# EAGLE design Motherboard v1 (EAGLE 9.7.0)
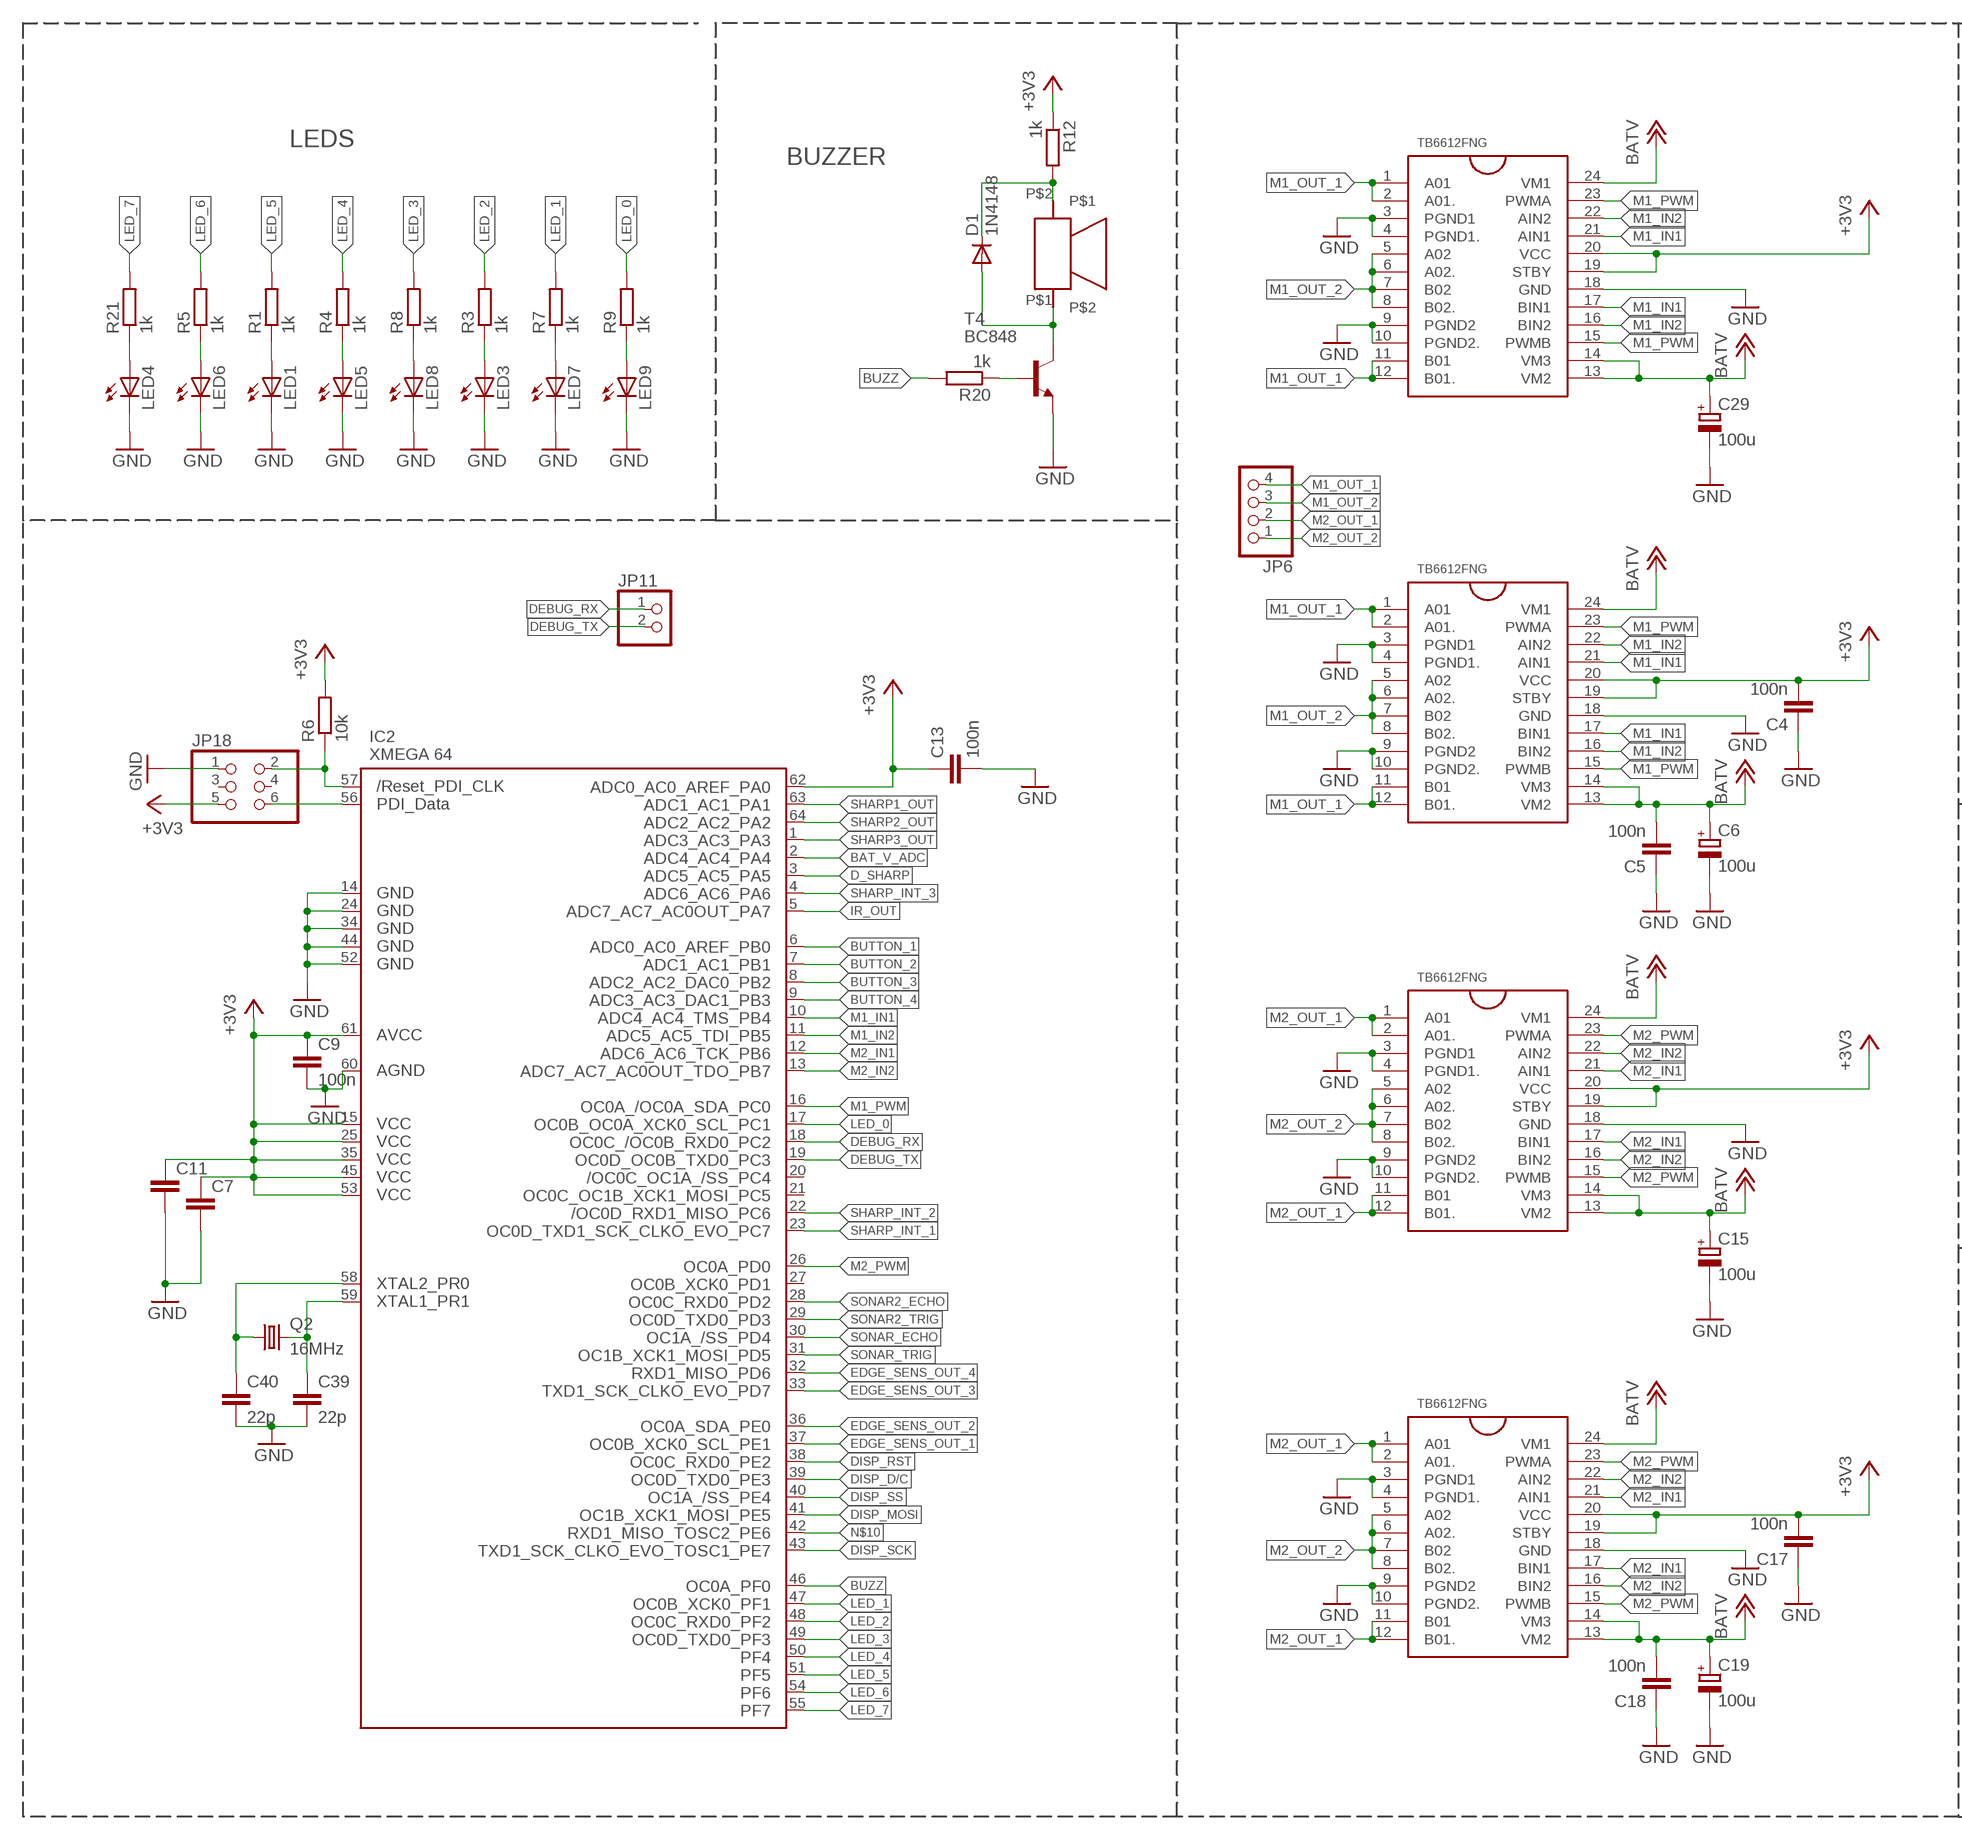
[diagram p0: schematic, sheet 1, part 1 of 2]
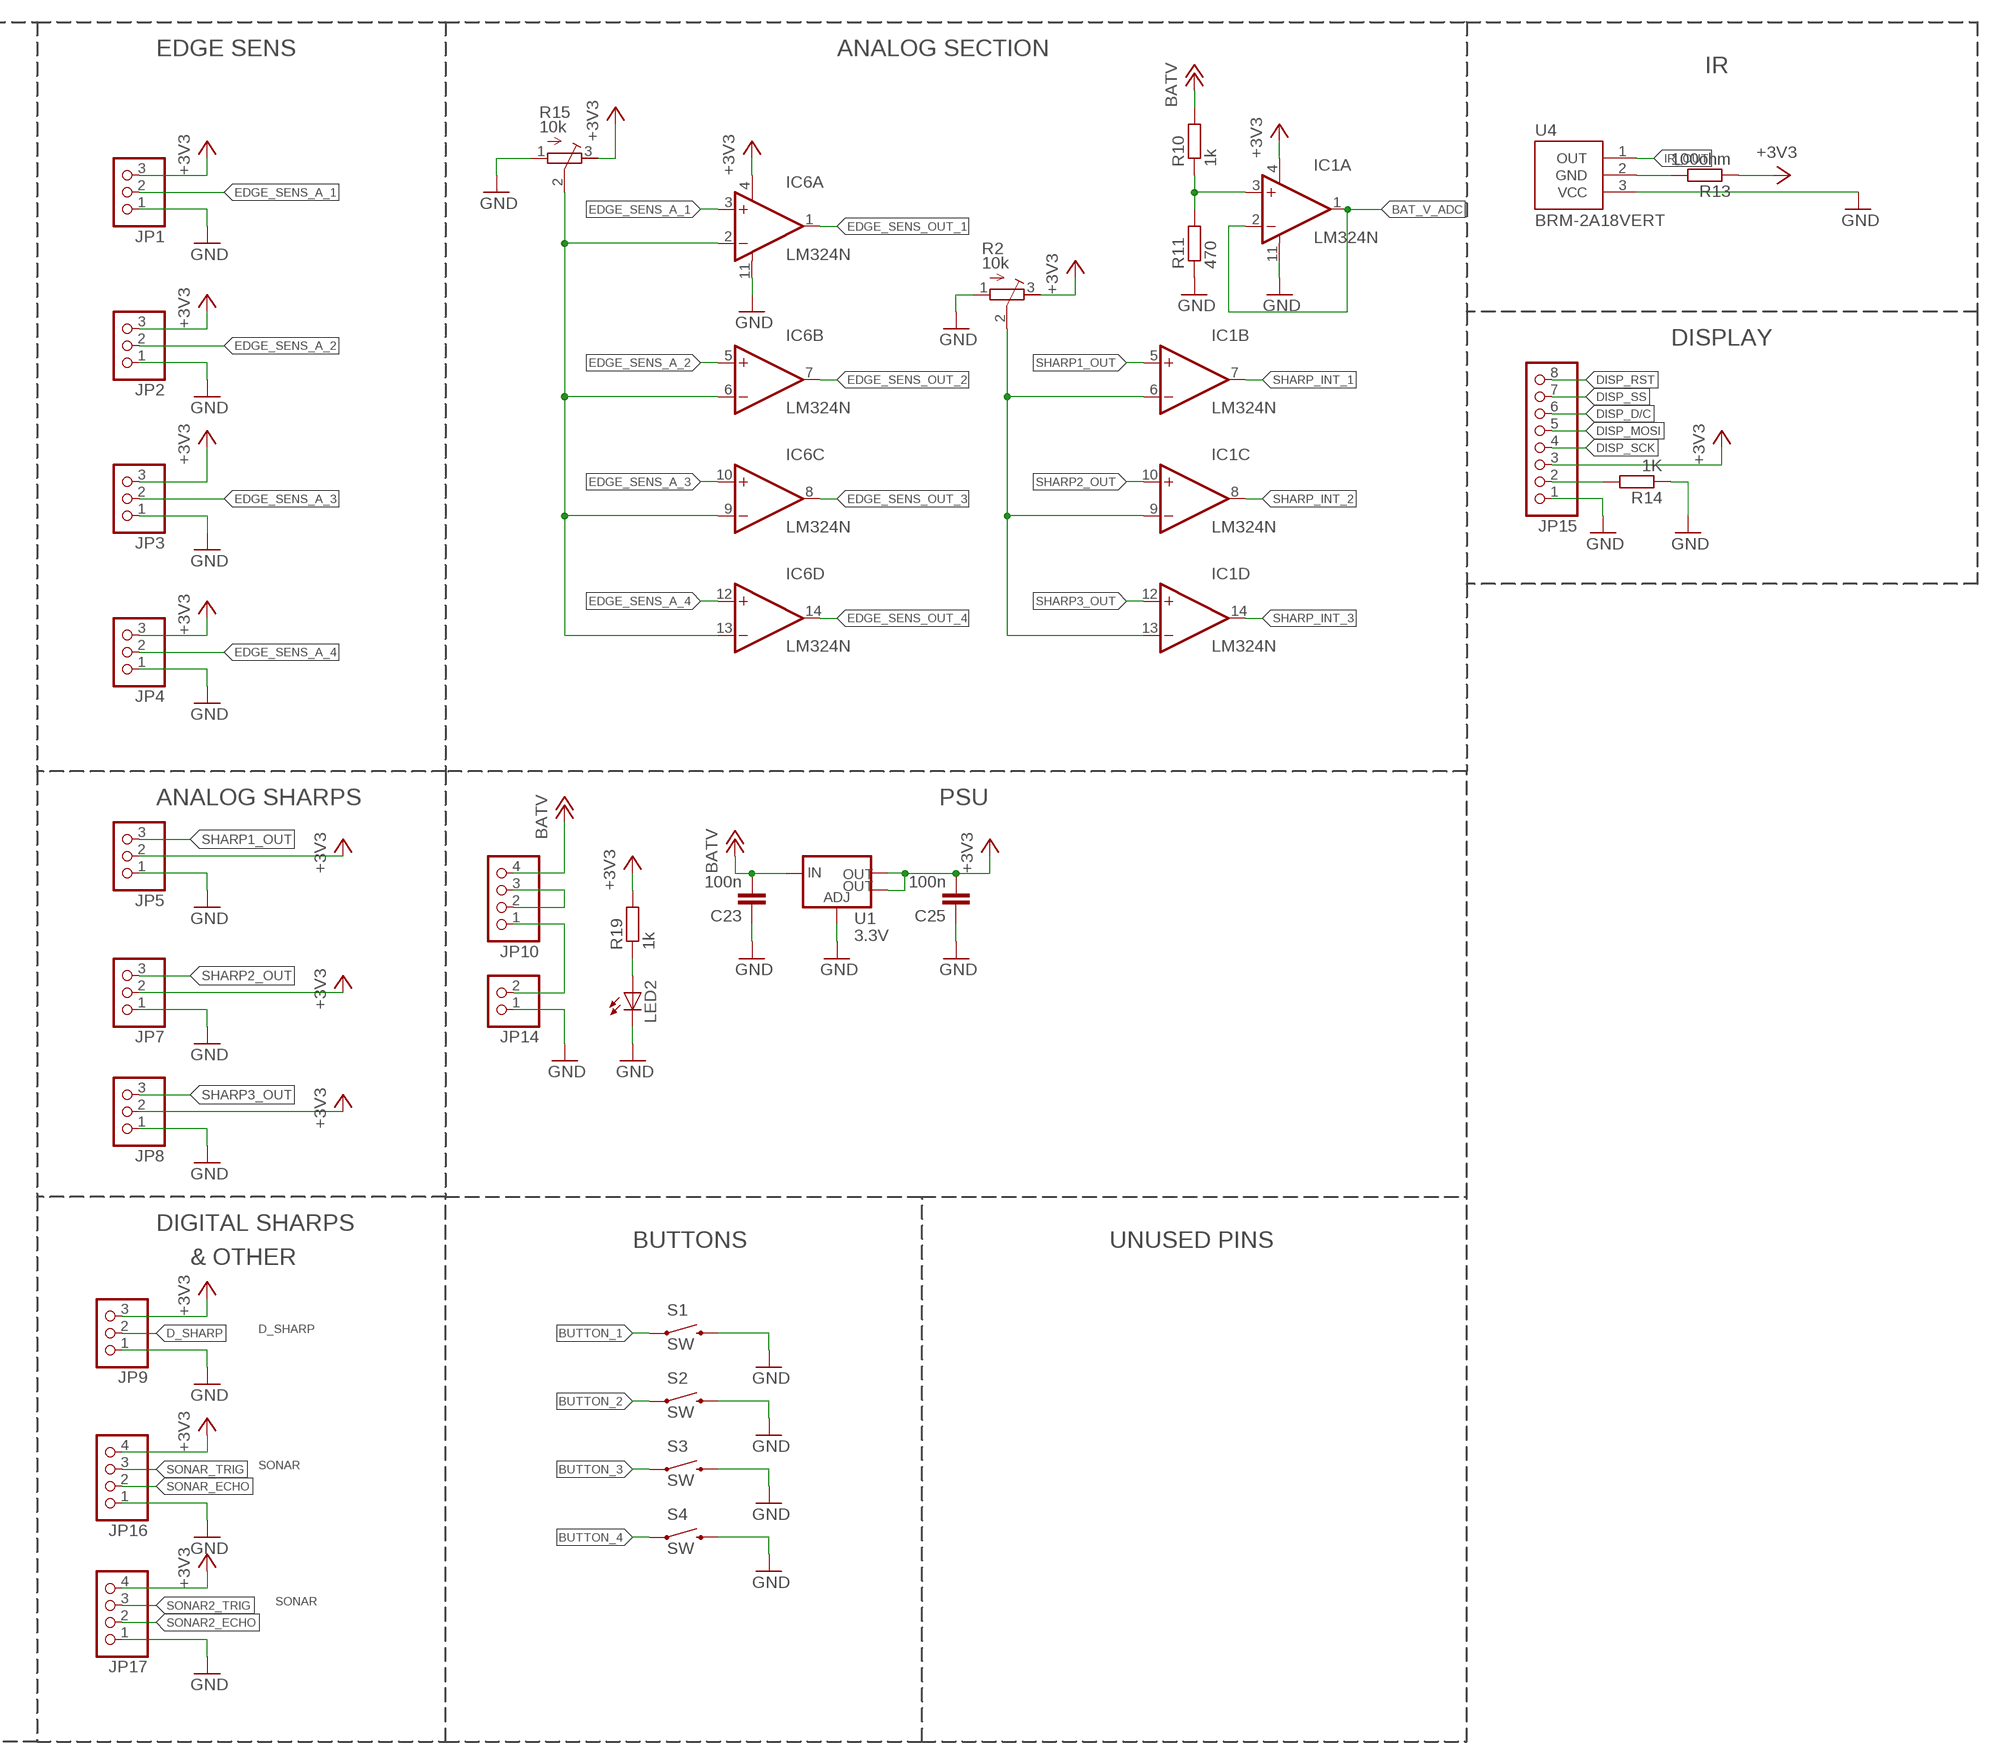
[diagram p1: schematic, sheet 1, part 2 of 2]

## Parts
C4  100n  C-EUC1206  [C1206]
C5  100n  C-EUC1206  [C1206]
C6  100u  CPOL-EU153CLV-0605  [153CLV-0605]
C7  C-EUC1206  [C1206]
C9  100n  C-EUC1206  [C1206]
C11  C-EUC1206  [C1206]
C13  100n  C-EUC1206  [C1206]
C15  100u  CPOL-EU153CLV-0605  [153CLV-0605]
C17  100n  C-EUC1206  [C1206]
C18  100n  C-EUC1206  [C1206]
C19  100u  CPOL-EU153CLV-0605  [153CLV-0605]
C23  100n  C-EUC1206  [C1206]
C25  100n  C-EUC1206  [C1206]
C29  100u  CPOL-EU153CLV-0605  [153CLV-0605]
C39  22p  C-EUC1206  [C1206]
C40  22p  C-EUC1206  [C1206]
D1  1N4148  ES2D  [SMB]
IC1  LM324N  OPA4130U  [SO14]
IC2  XMEGA 64  AVR_XMEGA_A3_  [TQFP64]
IC6  LM324N  OPA4130U  [SO14]
JP1  PINHD-1X3  [1X03]
JP2  PINHD-1X3  [1X03]
JP3  PINHD-1X3  [1X03]
JP4  PINHD-1X3  [1X03]
JP5  PINHD-1X3  [1X03]
JP6  PINHD-1X4/90  [1X04/90]
JP7  PINHD-1X3  [1X03]
JP8  PINHD-1X3  [1X03]
JP9  PINHD-1X3  [1X03]
JP10  PINHD-1X4/90  [1X04/90]
JP11  PINHD-1X2  [1X02]
JP14  PINHD-1X2  [1X02]
JP15  PINHD-1X8  [1X08]
JP16  PINHD-1X4  [1X04]
JP17  PINHD-1X4  [1X04]
JP18  PINHD-2X3  [2X03]
LED1  LEDCHIPLED_0805  [CHIPLED_0805]
LED2  LEDCHIPLED_0805  [CHIPLED_0805]
LED3  LEDCHIPLED_0805  [CHIPLED_0805]
LED4  LEDCHIPLED_0805  [CHIPLED_0805]
LED5  LEDCHIPLED_0805  [CHIPLED_0805]
LED6  LEDCHIP-LED0805  [CHIP-LED0805]
LED7  LEDCHIPLED_0805  [CHIPLED_0805]
LED8  LEDCHIP-LED0805  [CHIP-LED0805]
LED9  LEDCHIPLED_0805  [CHIPLED_0805]
Q2  16MHz  CSM-7X-DU  [CSM-7X-DU]
R1  1k  R-EU_R1206  [R1206]
R2  10k  R-TRIMMTSM53YL  [RTRIMTSM53YL]
R3  1k  R-EU_R1206  [R1206]
R4  1k  R-EU_R1206  [R1206]
R5  1k  R-EU_R1206  [R1206]
R6  10k  R-EU_R1206  [R1206]
R7  1k  R-EU_R1206  [R1206]
R8  1k  R-EU_R1206  [R1206]
R9  1k  R-EU_R1206  [R1206]
R10  1k  R-EU_R1206  [R1206]
R11  470  R-EU_R1206  [R1206]
R12  1k  R-EU_R1206  [R1206]
R13  100ohm  R-EU_R1206  [R1206]
R14  1K  R-EU_R1206  [R1206]
R15  10k  R-TRIMMTSM53YL  [RTRIMTSM53YL]
R19  1k  R-EU_R1206  [R1206]
R20  1k  R-EU_R1206  [R1206]
R21  1k  R-EU_R1206  [R1206]
S1  SW  SWITCH-MOMENTARY-2SMD-1101NE  [TACTILE-SWITCH-1101NE]
S2  SW  SWITCH-MOMENTARY-2SMD-1101NE  [TACTILE-SWITCH-1101NE]
S3  SW  SWITCH-MOMENTARY-2SMD-1101NE  [TACTILE-SWITCH-1101NE]
S4  SW  SWITCH-MOMENTARY-2SMD-1101NE  [TACTILE-SWITCH-1101NE]
T4  BC848  [SOT23]
U1  3.3V  V_REG_LM1117SOT223  [SOT223]
U4  BRM-2A18VERT  [BRM-2508_VERT]
U$1  TB6612FNG  [SSOP24]
U$2  TB6612FNG  [SSOP24]
U$3  TB6612FNG  [SSOP24]
U$4  TB6612FNG  [SSOP24]
U$13  BOT-03  [BOT-03D]

## Nets
+3V3: C4.2 C7.1 C9.1 C11.1 C13.1 C17.2 C25.2 IC1.4(A:V+) IC2.15(VCC1) IC2.25(VCC2) IC2.35(VCC3) IC2.45(VCC4) IC2.53(VCC5) IC2.61(AVCC) IC2.62(PA0) IC6.4(A:V+) JP1.3 JP2.3 JP3.3 JP4.3 JP5.2 JP7.2 JP8.2 JP9.3 JP15.3 JP16.4 JP17.4 JP18.5 R2.3(E) R6.2 R12.1 R13.1 R15.3(E) R19.2 U1.2(OUT) U1.4(OUT) U$1.19(STBY) U$1.20(VCC) U$2.19(STBY) U$2.20(VCC) U$3.19(STBY) U$3.20(VCC) U$4.19(STBY) U$4.20(VCC)
+12V: C5.2 C6.+ C15.+ C18.2 C19.+ C23.2 C29.+ JP10.4 R10.2 U1.3(IN) U$1.13(VM2) U$1.14(VM3) U$1.24(VM1) U$2.13(VM2) U$2.14(VM3) U$2.24(VM1) U$3.13(VM2) U$3.14(VM3) U$3.24(VM1) U$4.13(VM2) U$4.14(VM3) U$4.24(VM1) ; supply symbol labelled BATV
BAT_V_ADC: IC1.1(A:OUT) IC1.2(A:-IN) IC2.2(PA4)
BUTTON_1: IC2.6(PB0) S1.1
BUTTON_2: IC2.7(PB1) S2.1
BUTTON_3: IC2.8(PB2) S3.1
BUTTON_4: IC2.9(PB3) S4.1
BUZZ: IC2.46(PF0) R20.2
D_SHARP: IC2.3(PA5) JP9.2
DEBUG_RX: IC2.18(PC2) JP11.1
DEBUG_TX: IC2.19(PC3) JP11.2
DISP_D/C: IC2.39(PE3) JP15.6
DISP_MOSI: IC2.41(PE5) JP15.5
DISP_RST: IC2.38(PE2) JP15.8
DISP_SCK: IC2.43(PE7) JP15.4
DISP_SS: IC2.40(PE4) JP15.7
EDGE_SENS_A_1: IC6.3(A:+IN) JP1.2
EDGE_SENS_A_2: IC6.5(B:+IN) JP2.2
EDGE_SENS_A_3: IC6.10(C:+IN) JP3.2
EDGE_SENS_A_4: IC6.12(D:+IN) JP4.2
EDGE_SENS_OUT_1: IC2.37(PE1) IC6.1(A:OUT)
EDGE_SENS_OUT_2: IC2.36(PE0) IC6.7(B:OUT)
EDGE_SENS_OUT_3: IC2.33(PD7) IC6.8(C:OUT)
EDGE_SENS_OUT_4: IC2.32(PD6) IC6.14(D:OUT)
GND: C4.1 C5.1 C6.- C7.2 C9.2 C11.2 C13.2 C15.- C17.1 C18.1 C19.- C23.1 C25.1 C29.- C39.2 C40.2 IC1.11(A:V-) IC2.14(GND1) IC2.24(GND2) IC2.34(GND3) IC2.44(GND4) IC2.52(GND5) IC2.60(AGND) IC6.11(A:V-) JP1.1 JP2.1 JP3.1 JP4.1 JP5.1 JP7.1 JP8.1 JP9.1 JP14.1 JP15.1 JP16.1 JP17.1 JP18.1 LED1.C LED2.C LED3.C LED4.C LED5.C LED6.C LED7.C LED8.C LED9.C R2.1(A) R11.1 R14.1 R15.1(A) S1.2 S2.2 S3.2 S4.2 T4.2(E) U1.1(ADJ) U4.3(VCC) U$1.3(PGND1) U$1.4(PGND1.) U$1.9(PGND2) U$1.10(PGND2.) U$1.18(GND) U$2.3(PGND1) U$2.4(PGND1.) U$2.9(PGND2) U$2.10(PGND2.) U$2.18(GND) U$3.3(PGND1) U$3.4(PGND1.) U$3.9(PGND2) U$3.10(PGND2.) U$3.18(GND) U$4.3(PGND1) U$4.4(PGND1.) U$4.9(PGND2) U$4.10(PGND2.) U$4.18(GND)
IR_OUT: IC2.5(PA7) U4.1(OUT)
LED_0: IC2.17(PC1) R9.2
LED_1: IC2.47(PF1) R7.2
LED_2: IC2.48(PF2) R3.2
LED_3: IC2.49(PF3) R8.2
LED_4: IC2.50(PF4) R4.2
LED_5: IC2.51(PF5) R1.2
LED_6: IC2.54(PF6) R5.2
LED_7: IC2.55(PF7) R21.2
M1_IN1: IC2.10(PB4) U$1.17(BIN1) U$1.21(AIN1) U$2.17(BIN1) U$2.21(AIN1)
M1_IN2: IC2.11(PB5) U$1.16(BIN2) U$1.22(AIN2) U$2.16(BIN2) U$2.22(AIN2)
M1_OUT_1: JP6.4 U$1.1(A01) U$1.2(A01.) U$1.11(B01) U$1.12(B01.) U$2.1(A01) U$2.2(A01.) U$2.11(B01) U$2.12(B01.)
M1_OUT_2: JP6.3 U$1.5(A02) U$1.6(A02.) U$1.7(B02) U$1.8(B02.) U$2.5(A02) U$2.6(A02.) U$2.7(B02) U$2.8(B02.)
M1_PWM: IC2.16(PC0) U$1.15(PWMB) U$1.23(PWMA) U$2.15(PWMB) U$2.23(PWMA)
M2_IN1: IC2.12(PB6) U$3.17(BIN1) U$3.21(AIN1) U$4.17(BIN1) U$4.21(AIN1)
M2_IN2: IC2.13(PB7) U$3.16(BIN2) U$3.22(AIN2) U$4.16(BIN2) U$4.22(AIN2)
M2_OUT_1: JP6.2 U$3.1(A01) U$3.2(A01.) U$3.11(B01) U$3.12(B01.) U$4.1(A01) U$4.2(A01.) U$4.11(B01) U$4.12(B01.)
M2_OUT_2: JP6.1 U$3.5(A02) U$3.6(A02.) U$3.7(B02) U$3.8(B02.) U$4.5(A02) U$4.6(A02.) U$4.7(B02) U$4.8(B02.)
M2_PWM: IC2.26(PD0) U$3.15(PWMB) U$3.23(PWMA) U$4.15(PWMB) U$4.23(PWMA)
N$1: LED1.A R1.1
N$2: LED5.A R4.1
N$3: LED6.A R5.1
N$4: LED3.A R3.1
N$5: LED7.A R7.1
N$6: LED8.A R8.1
N$7: LED9.A R9.1
N$8: R13.2 U4.2(GND)
N$9: JP10.2 JP10.3
N$10: IC2.42(PE6)
N$11: D1.C R12.2 U$13.P$2
N$14: IC2.56(PDI_DATA) JP18.6
N$15: IC2.57(RESET) JP18.2 R6.1
N$16: JP10.1 JP14.2
N$17: IC1.6(B:-IN) IC1.9(C:-IN) IC1.13(D:-IN) R2.2(S)
N$18: D1.A T4.3(C) U$13.P$1
N$21: R20.1 T4.1(B)
N$22: IC6.2(A:-IN) IC6.6(B:-IN) IC6.9(C:-IN) IC6.13(D:-IN) R15.2(S)
N$24: JP15.2 R14.2
N$27: IC1.3(A:+IN) R10.1 R11.2
N$64: C40.1 IC2.58(PR0) Q2.1
N$65: C39.1 IC2.59(PR1) Q2.2
N$67: LED2.A R19.1
N$69: LED4.A R21.1
SHARP1_OUT: IC1.5(B:+IN) IC2.63(PA1) JP5.3
SHARP2_OUT: IC1.10(C:+IN) IC2.64(PA2) JP7.3
SHARP3_OUT: IC1.12(D:+IN) IC2.1(PA3) JP8.3
SHARP_INT_1: IC1.7(B:OUT) IC2.23(PC7)
SHARP_INT_2: IC1.8(C:OUT) IC2.22(PC6)
SHARP_INT_3: IC1.14(D:OUT) IC2.4(PA6)
SONAR2_ECHO: IC2.28(PD2) JP17.2
SONAR2_TRIG: IC2.29(PD3) JP17.3
SONAR_ECHO: IC2.30(PD4) JP16.2
SONAR_TRIG: IC2.31(PD5) JP16.3
Unconnected: IC2.20(PC4) IC2.21(PC5) IC2.27(PD1) JP18.3 JP18.4

## Notes on the sheet
- EDGE SENS | ANALOG SECTION
- IR
- LEDS
- BUZZER
- DISPLAY
- ANALOG SHARPS | PSU
- DIGITAL SHARPS
- BUTTONS | UNUSED PINS
- & OTHER
- D_SHARP
- SONAR
- SONAR

## Library data of the parts
C4 C5 C7 C9 C11 C13 C17 C18 C23 C25 C39 C40 = rcl:C-EU: CAPACITOR, European symbol
C6 C15 C19 C29 = resistor:CPOL-EU: POLARIZED CAPACITOR, European symbol
D1 = diode:ES2D: DIODE super fast rectifier, 2 A
IC1 IC6 = burr-brown:OPA4130: Low Power, Precision FET-Input Operational Amplifiers; MF: TEXAS INSTRUMENTS; MPN: OPA4130UA; OC_FARNELL: 1648707; OC_NEWARK: 80K8080
IC2 = xmega:AVR_XMEGA_A3_: Device for Atmel AVR XMEGA A3 Series
JP1-JP5 JP7-JP9 = pinhead:PINHD-1X3: PIN HEADER
JP6 JP10 JP16 JP17 = pinhead:PINHD-1X4: PIN HEADER
JP11 JP14 = pinhead:PINHD-1X2: PIN HEADER
JP15 = pinhead:PINHD-1X8: PIN HEADER
JP18 = pinhead:PINHD-2X3: PIN HEADER
LED1-LED9 = led:LED: LED OSRAM: - CHIPLED LG R971, LG N971, LY N971, LG Q971, LY Q971, LO R971, LY R971 LH N974, LH R974 LS Q976, LO Q976, LY Q976 LO Q996 - Hyper CHIPLED LW Q18S LB Q993, LB Q99A, LB R99A - SideLED LS A670, LO A670, LY A670, LG A670, LP A670 LB A673, LV A673, LT A673, LW A673 LH A674 LY A675 LS A676, LA A676, LO A676, LY A676, LW A676 LS A679, LY A679, LG A679 - Hyper Micro SIDELED® LS Y876, LA Y876, LO Y876, LY Y876 LT Y87S - SmartLED LW L88C, LW L88S LB L89C, LB L89S, LG L890 LS L89K, LO L89K, LY L89K LS L896, LA L896, LO L896, LY L896 - TOPLED LS T670, LO T670, LY T670, LG T670, LP T670 LSG T670, LSP T670, LSY T670, LOP T670, LYG T670 LG T671, LOG T671, LSG T671 LB T673, LV T673, LT T673, LW T673 LH T674 LS T676, LA T676, LO T676, LY T676, LB T676, LH T676, LSB T676, LW T676 LB T67C, LV T67C, LT T67C, LS T67K, LO T67K, LY T67K, LW E67C LS E67B, LA E67B, LO E67B, LY E67B, LB E67C, LV E67C, LT E67C LW T67C LS T679, LY T679, LG T679 LS T770, LO T770, LY T770, LG T770, LP T770 LB T773, LV T773, LT T773, LW T773 LH T774 LS E675, LA E675, LY E675, LS T675 LS T776, LA T776, LO T776, LY T776, LB T776 LHGB T686 LT T68C, LB T68C - Hyper Mini TOPLED® LB M676 - Mini TOPLED Santana® LG M470 LS M47K, LO M47K, LY M47K Source: http://www.osram.convergy.de LUXEON: - LUMILED® LXK2-PW12-R00, LXK2-PW12-S00, LXK2-PW14-U00, LXK2-PW14-V00 LXK2-PM12-R00, LXK2-PM12-S00, LXK2-PM14-U00 LXK2-PE12-Q00, LXK2-PE12-R00, LXK2-PE12-S00, LXK2-PE14-T00, LXK2-PE14-U00 LXK2-PB12-K00, LXK2-PB12-L00, LXK2-PB12-M00, LXK2-PB14-N00, LXK2-PB14-P00, LXK2-PB14-Q00 LXK2-PR12-L00, LXK2-PR12-M00, LXK2-PR14-Q00, LXK2-PR14-R00 LXK2-PD12-Q00, LXK2-PD12-R00, LXK2-PD12-S00 LXK2-PH12-R00, LXK2-PH12-S00 LXK2-PL12-P00, LXK2-PL12-Q00, LXK2-PL12-R00 Source: www.luxeon.com KINGBRIGHT: KA-3528ASYC Source: www.kingbright.com
Q2 = crystal:CSM-7X-DU: SMD CRYSTAL Source: www.ecsxtal.com .. Crystal 3.6864MHz CSM_7X_DU.PDF; OC_FARNELL: unknown; OC_NEWARK: unknown
R1 R3-R14 R19-R21 = rcl:R-EU_: RESISTOR, European symbol
R2 R15 = rcl:R-TRIMM: Trimm resistor
S1-S4 = SparkFun-Electromechanical:SWITCH-MOMENTARY-2: Various NO switches- pushbuttons, reed, etc; PROD_ID: SWCH-00815
T4 = transistor:BC848: NPN TRANSISTOR
U1 = SparkFun-PowerIC:V_REG_LM1117: Voltage Regulator LM1117 Standard adjustable voltage regulator but in SMD form. Spark Fun Electronics SKU : COM-00595; PROD_ID: VREG-08170
U4 = SparkFun-Sensors:BRM-2A18: BRM-2A18 IR receiver.; PROD_ID: COMP-12505
U$1-U$4 = TB6612FNG:TB6612FNG
U$13 = bot3:BOT-03

## Board
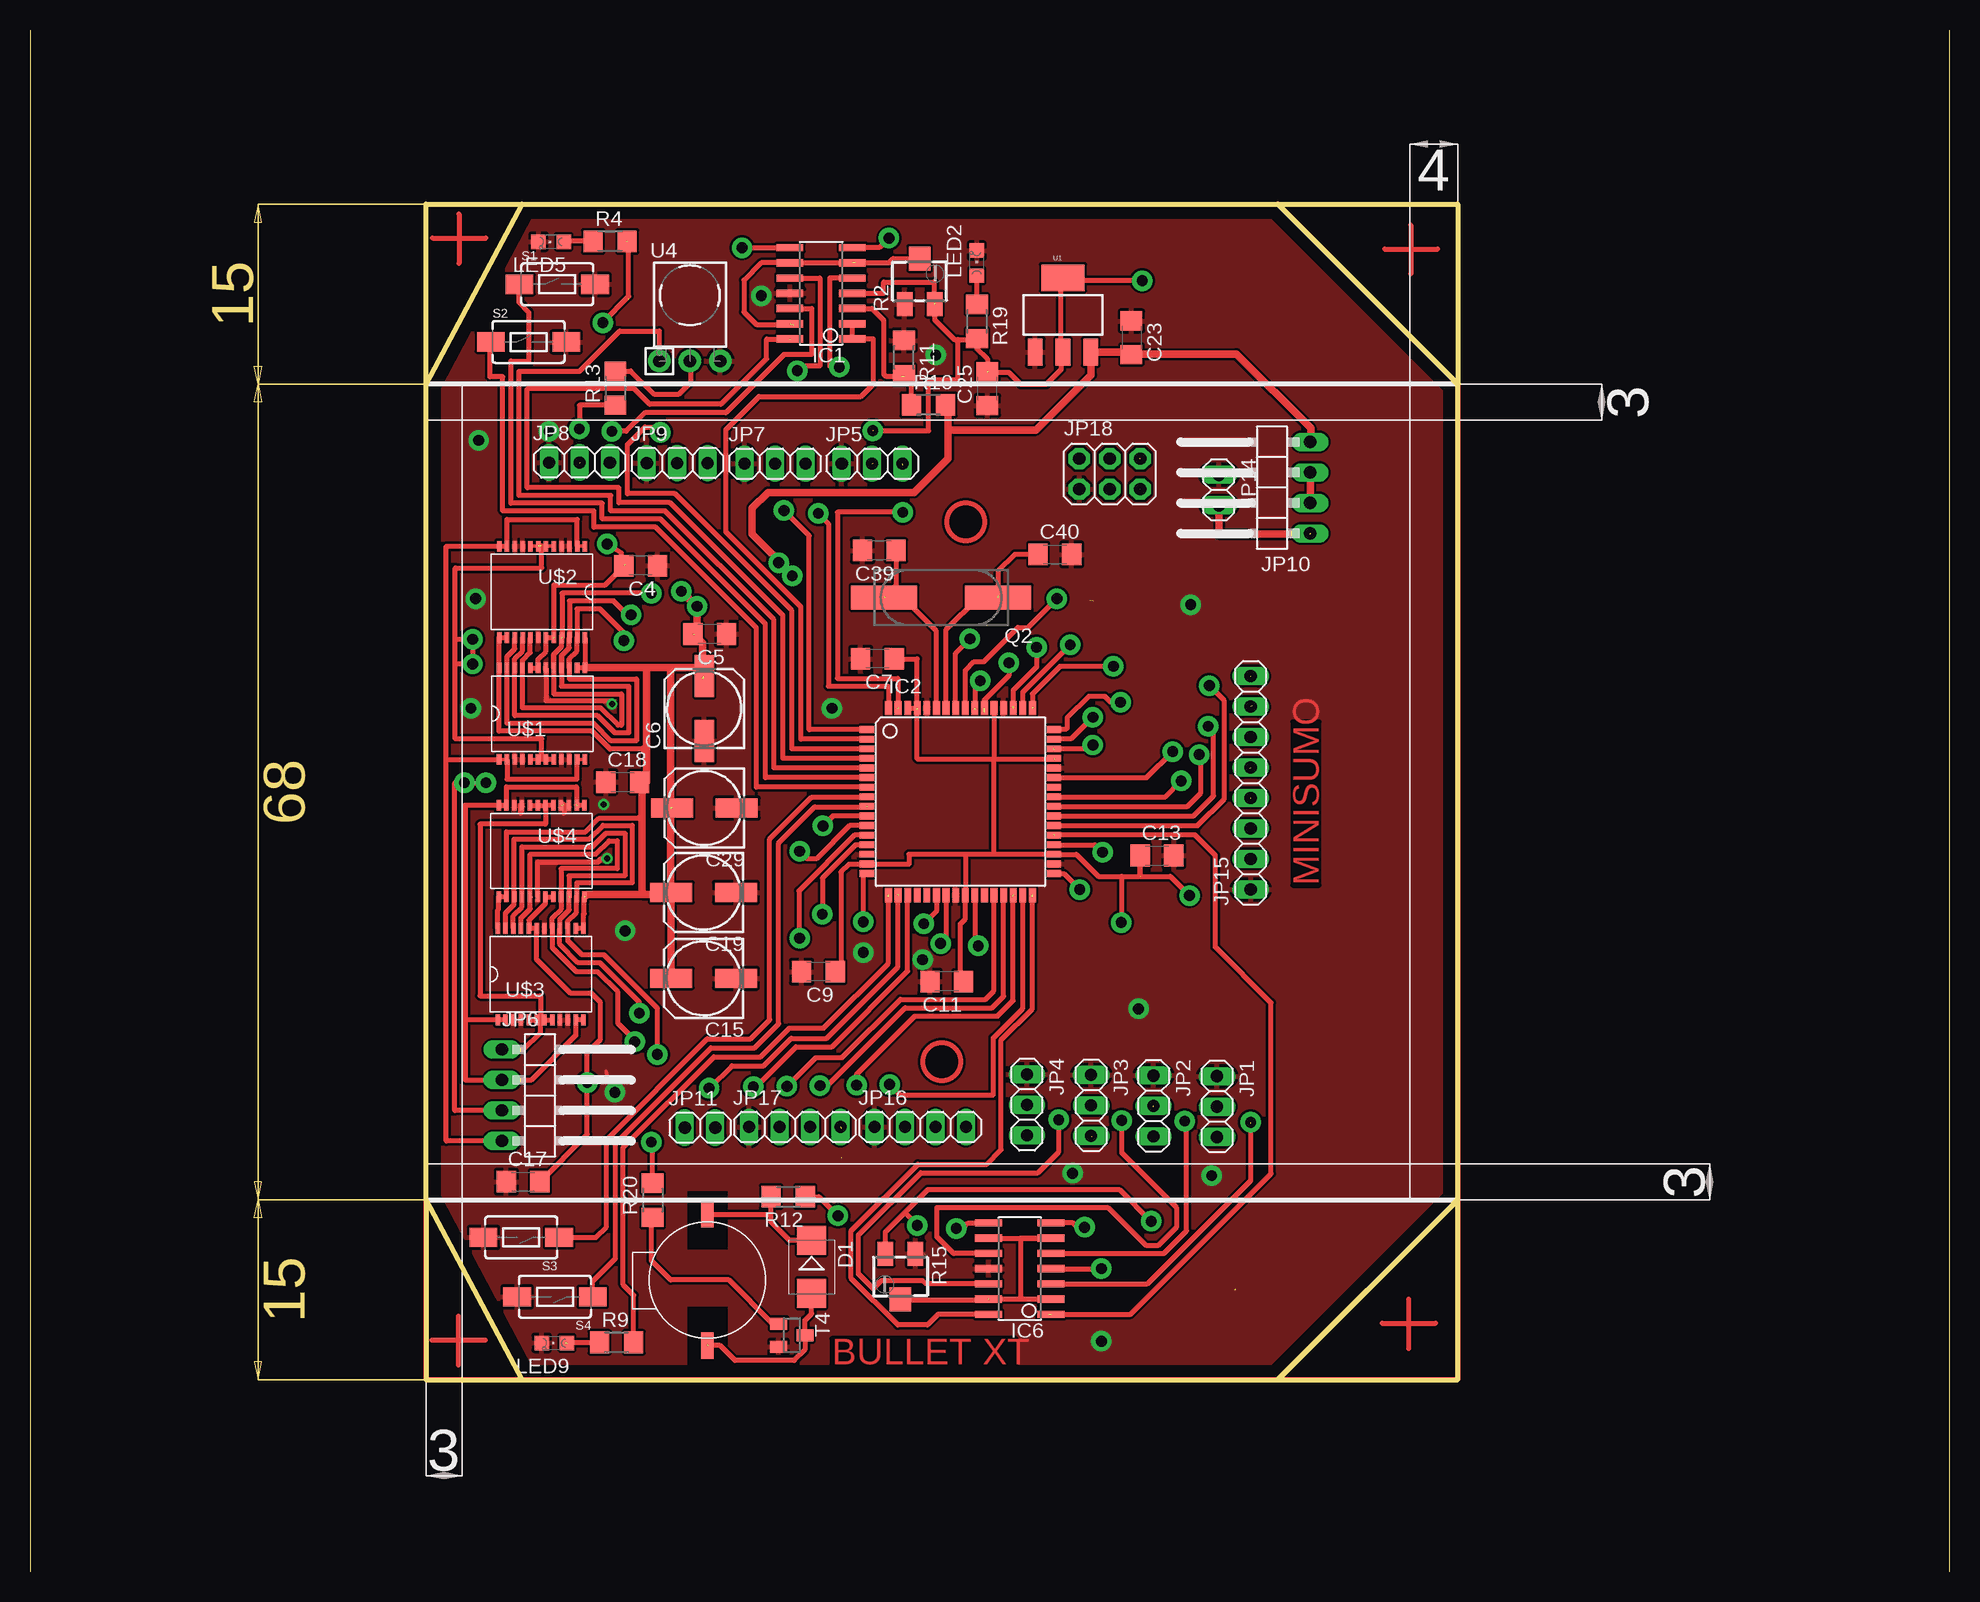
[diagram p2: board, top side]
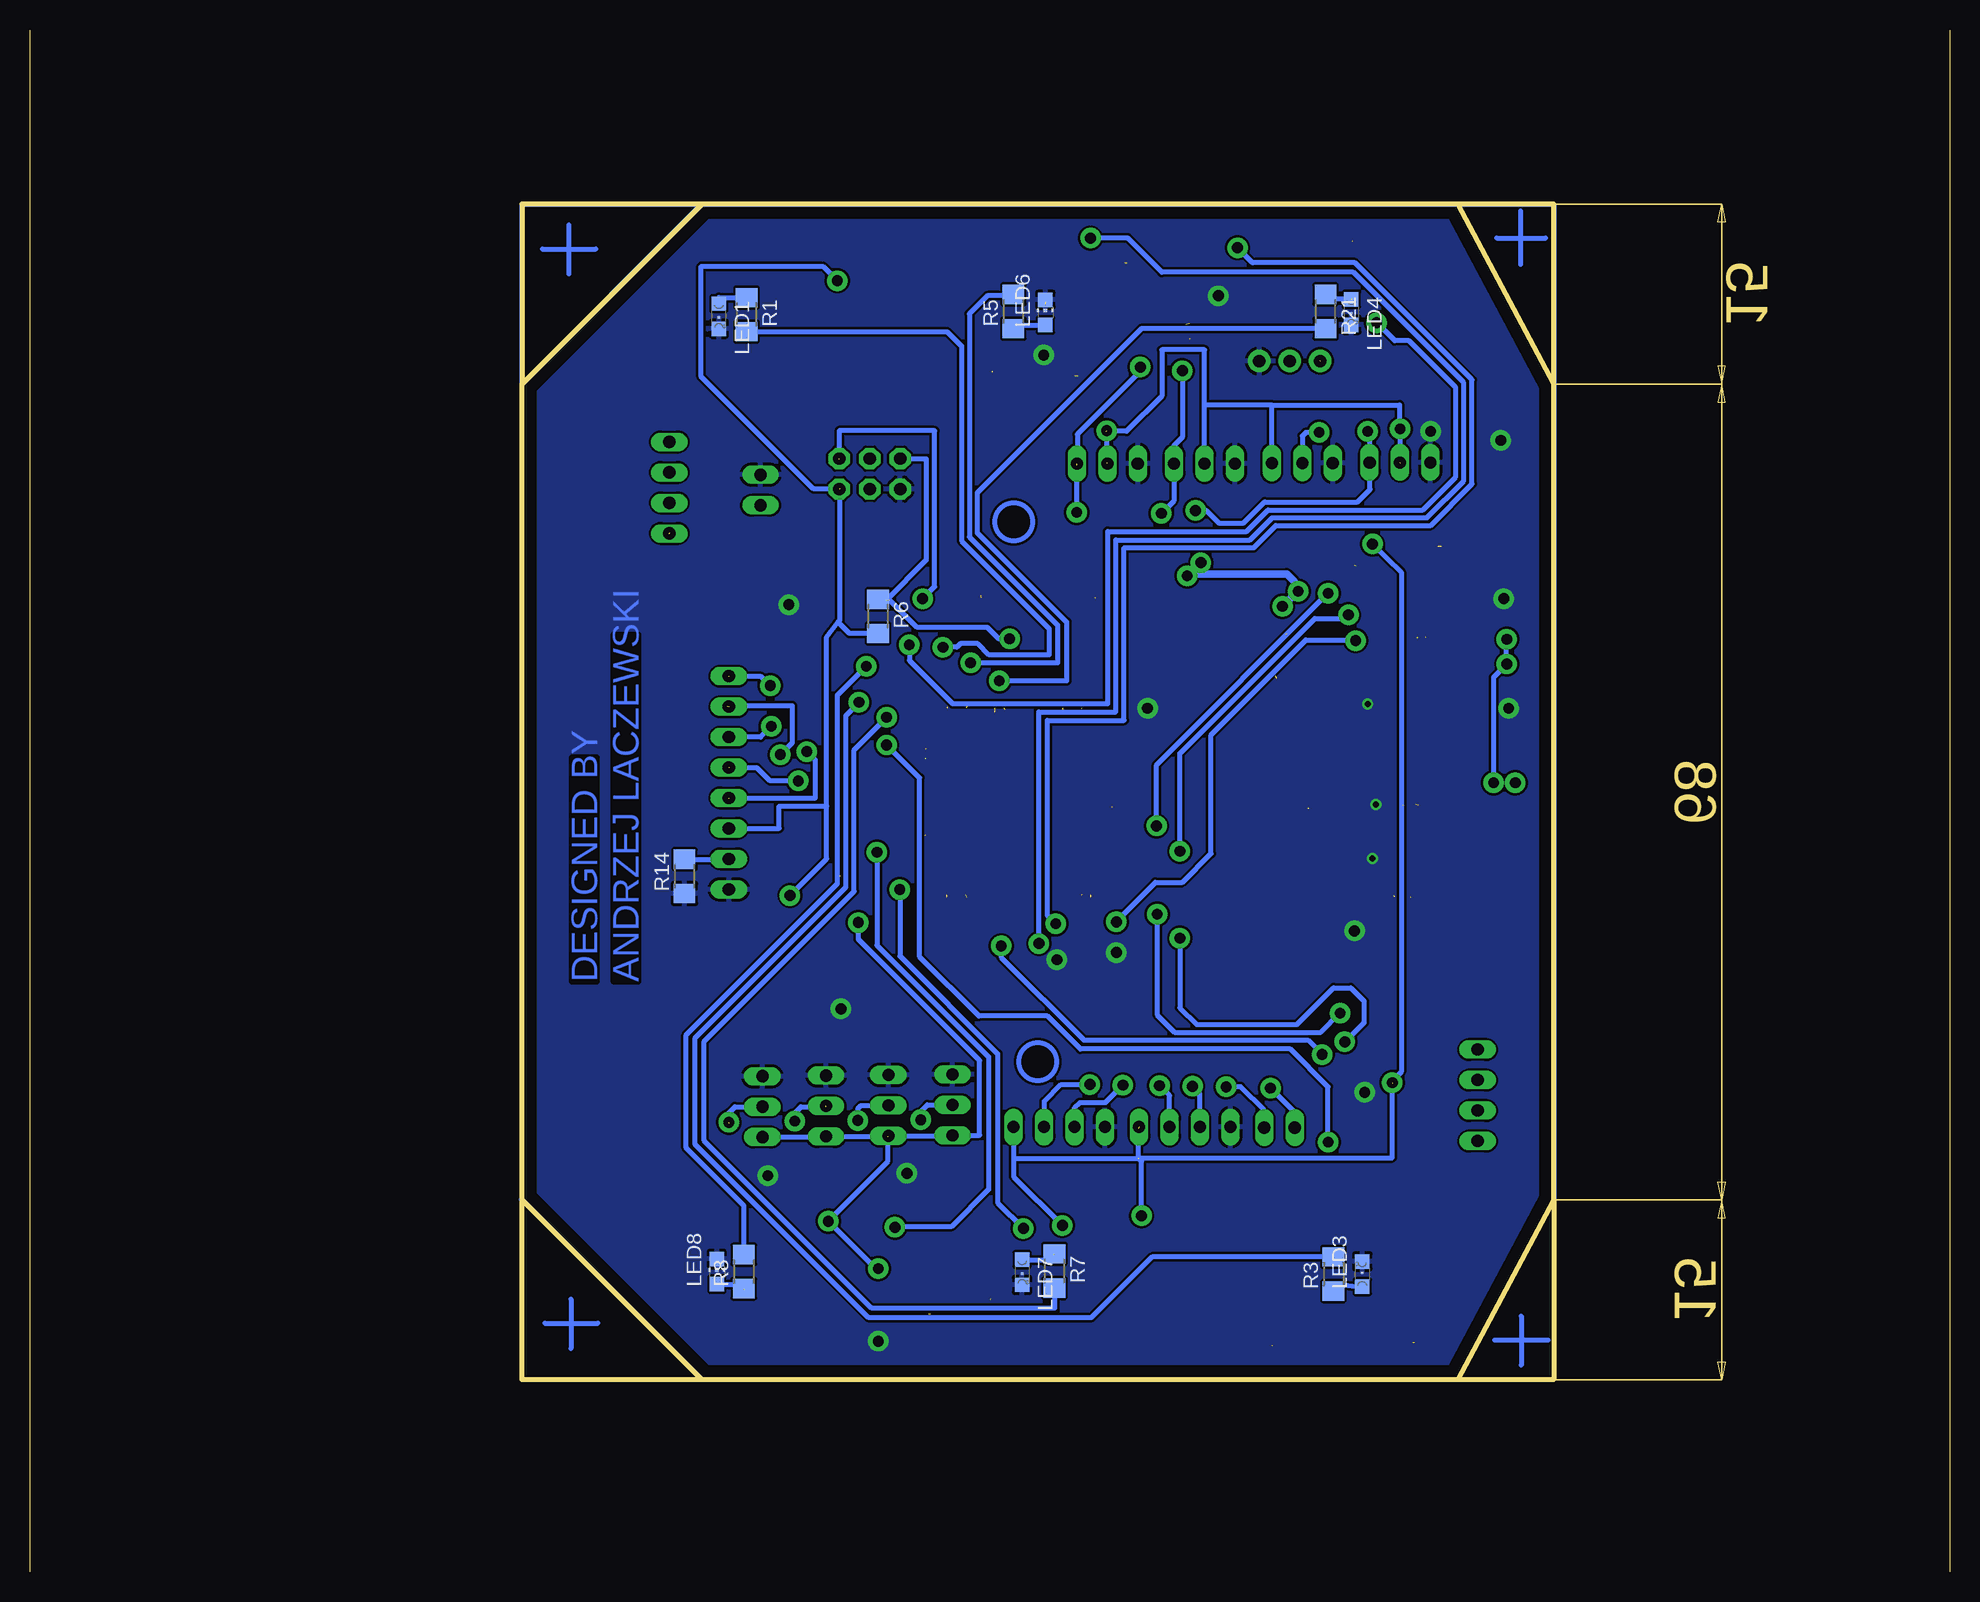
[diagram p3: board, bottom side, seen from below]

Size 160 x 128.5 mm. Coordinates in mm from the lower left corner, seen from the top.
Outline: 160,0 160,128.5
Outline: 0,128.5 0,0
Outline: 33,31 33,99
Outline: 119,31 119,99
Outline: 33,99 33,114 41,114
Outline: 41,114 104,114
Outline: 104,114 119,114 119,99
Outline: 33,31 33,16 41,16
Outline: 41,16 104,16
Outline: 104,16 119,16 119,31
Outline: 33,99 41,114
Outline: 33,31 41,16
Outline: 119,99 104,114
Outline: 119,31 104,16
Copper layers (1*16): Top 0.035mm / dielectric 1.5mm / Bottom 0.035mm
Design rules "Fusion Electronics Design Rules": minimum track width 10mil, minimum drill 24mil, track to track 8mil, track to pad 8mil, pad to pad 8mil, via to via 8mil, smd to smd 8mil, copper to edge 40mil, drill to drill 8mil, minimum pad ring 10mil, minimum via ring 8mil, stop-mask expansion 4mil, vias tented up to drill 0mil, thermal gap 10mil
tRestrict: area 54.8,17.2 to 58.1,22.1; area 54.8,26.8 to 58.1,31.7

### Footprints (pad centres in the part's own frame; a part is rotated, then mirrored left to right if it is on the bottom)
C1206 = smd 1.6 x 1.8: 1 -1.4,0; 2 1.4,0
153CLV-0605 = smd 3.5 x 1.6: + 2.7,0; - -2.7,0
SMB = smd 2.4 x 2.4: A 2.2,0; C -2.2,0
SO14 = smd 0.61 x 2.21: 1 -3.81,-2.603; 2 -2.54,-2.603; 3 -1.27,-2.603; 4 0,-2.603; 5 1.27,-2.603; 6 2.54,-2.603; 7 3.81,-2.603; 8 3.81,2.603; 9 2.54,2.603; 10 1.27,2.603; 11 0,2.603; 12 -1.27,2.603; 13 -2.54,2.603; 14 -3.81,2.603
TQFP64 = smd 1.194 x 0.559: 1 -7.8,6; 2 -7.8,5.2; 3 -7.8,4.4; 4 -7.8,3.6; 5 -7.8,2.8; 6 -7.8,2; 7 -7.8,1.2; 8 -7.8,0.4; 9 -7.8,-0.4; 10 -7.8,-1.2; 11 -7.8,-2; 12 -7.8,-2.8; 13 -7.8,-3.6; 14 -7.8,-4.4; 15 -7.8,-5.2; 16 -7.8,-6; 33 7.8,-6; 34 7.8,-5.2; 35 7.8,-4.4; 36 7.8,-3.6; 37 7.8,-2.8; 38 7.8,-2; 39 7.8,-1.2; 40 7.8,-0.4; 41 7.8,0.4; 42 7.8,1.2; 43 7.8,2; 44 7.8,2.8; 45 7.8,3.6; 46 7.8,4.4; 47 7.8,5.2; 48 7.8,6 | smd 0.559 x 1.194: 17 -6,-7.8; 18 -5.2,-7.8; 19 -4.4,-7.8; 20 -3.6,-7.8; 21 -2.8,-7.8; 22 -2,-7.8; 23 -1.2,-7.8; 24 -0.4,-7.8; 25 0.4,-7.8; 26 1.2,-7.8; 27 2,-7.8; 28 2.8,-7.8; 29 3.6,-7.8; 30 4.4,-7.8; 31 5.2,-7.8; 32 6,-7.8; 49 6,7.8; 50 5.2,7.8; 51 4.4,7.8; 52 3.6,7.8; 53 2.8,7.8; 54 2,7.8; 55 1.2,7.8; 56 0.4,7.8; 57 -0.4,7.8; 58 -1.2,7.8; 59 -2,7.8; 60 -2.8,7.8; 61 -3.6,7.8; 62 -4.4,7.8; 63 -5.2,7.8; 64 -6,7.8
1X03 = drill 1.016 long: 1 -2.54,0; 2 0,0; 3 2.54,0
1X04/90 = drill 1.016 long: 1 -3.81,-3.81; 2 -1.27,-3.81; 3 1.27,-3.81; 4 3.81,-3.81
1X02 = drill 1.016 long: 1 -1.27,0; 2 1.27,0
1X08 = drill 1.016 long: 1 -8.89,0; 2 -6.35,0; 3 -3.81,0; 4 -1.27,0; 5 1.27,0; 6 3.81,0; 7 6.35,0; 8 8.89,0
1X04 = drill 1.016 long: 1 -3.81,0; 2 -1.27,0; 3 1.27,0; 4 3.81,0
2X03 = drill 1.016 pad 1.778 octagon: 1 -2.54,-1.27; 2 -2.54,1.27; 3 0,-1.27; 4 0,1.27; 5 2.54,-1.27; 6 2.54,1.27
CHIPLED_0805 = smd 1.2 x 1.2: A 0,-1.05; C 0,1.05
CHIP-LED0805 = smd 1.2 x 1.2: A 0,-1.05; C 0,1.05
CSM-7X-DU = smd 5.5 x 2: 1 -4.75,0; 2 4.75,0
R1206 = smd 1.6 x 1.803: 1 -1.422,0; 2 1.422,0
RTRIMTSM53YL = smd 1.3 x 2: 1 -1.25,-1.9; 3 1.25,-1.9 | smd 1.8 x 2: 2 0,1.9
TACTILE-SWITCH-1101NE = smd 2.3 x 1.6: 1 -3.15,0; 2 3.15,0
SOT23 = smd 1 x 1.4: 1 -0.95,-1.1; 2 0.95,-1.1; 3 0,1.1
SOT223 = smd 1.219 x 2.235: 1 -2.311,-3.099; 2 0,-3.099; 3 2.311,-3.099 | smd 3.6 x 2.2: 4 0,3.099
BRM-2508_VERT = drill 1.016 pad 1.88: 1 -2.54,0; 2 0,0; 3 2.54,0
SSOP24 = smd 0.381 x 0.889: 1 -3.567,-3.72; 2 -2.917,-3.72; 3 -2.268,-3.72; 4 -1.617,-3.72; 5 -0.968,-3.72; 6 -0.318,-3.72; 7 0.333,-3.72; 8 0.983,-3.72; 9 1.633,-3.72; 10 2.283,-3.72; 11 2.933,-3.72; 12 3.583,-3.72; 13 3.583,3.9; 14 2.933,3.9; 15 2.283,3.9; 16 1.633,3.9; 17 0.983,3.9; 18 0.333,3.9; 19 -0.318,3.9; 20 -0.968,3.9; 21 -1.617,3.9; 22 -2.268,3.9; 23 -2.917,3.9; 24 -3.567,3.9
BOT-03D = smd 2.184 x 1.067: P$1 -5.461,-0.254; P$2 5.461,-0.254

### Placement (x,y rotation side)
C4  50.9,83.85 180 top
C5  56.65,78.15 180 top
C6  56.2,71.95 90 top
C7  70.64,76.08 180 top
C9  65.72,50 180 top
C11  76.42,49.18 180 top
C13  93.94,59.69 0 top
C15  56.15,49.45 180 top
C17  41.1,32.5 0 top
C18  49.4,65.8 0 top
C19  56.15,56.6 180 top
C23  91.8,102.85 270 top
C25  79.8,98.6 90 top
C29  56.2,63.65 180 top
C39  70.79,85.11 180 top
C40  85.43,84.79 0 top
D1  65.15,25.4 270 top
IC1  65.95,106.55 90 top
IC2  77.56,64.18 0 top
IC6  82.5,25.25 90 top
JP1  98.95,38.75 270 top
JP2  93.65,38.8 270 top
JP3  88.45,38.85 270 top
JP4  83.1,38.9 270 top
JP5  70.2,92.35 0 top
JP6  43.15,39.7 270 top
JP7  62.1,92.35 0 top
JP8  45.8,92.45 0 top
JP9  53.95,92.4 0 top
JP10  102.9,90.35 90 top
JP11  55.85,37 0 top
JP14  99.1,90.15 270 top
JP15  101.75,65.75 90 top
JP16  74.2,37.05 0 top
JP17  63.75,37.05 0 top
JP18  90,91.5 0 top
LED1  102.58,104.64 180 bottom
LED2  78.92,109.07 0 top
LED3  48.95,24.8 0 bottom
LED4  49.86,104.98 180 bottom
LED5  43.44,110.85 90 top
LED6  75.37,104.96 0 bottom
LED7  77.3,24.95 180 bottom
LED8  102.75,25 0 bottom
LED9  43.7,19.05 90 top
Q2  75.95,81.2 180 top
R1  100.27,104.77 270 bottom
R2  74.15,107.55 0 top
R3  51.35,24.8 90 bottom
R4  48.36,110.88 0 top
R5  78.03,105.03 90 bottom
R6  89.31,79.62 270 bottom
R7  74.6,25.05 270 bottom
R8  100.5,25 90 bottom
R9  48.9,19.1 0 top
R10  74.9,97.25 0 top
R11  72.85,101.2 270 top
R12  63.2,31.25 180 top
R13  48.8,98.65 90 top
R14  105.45,57.95 90 bottom
R15  72.55,24.6 180 top
R19  78.94,104.2 270 top
R20  51.9,30.95 90 top
R21  52.01,105.03 270 bottom
S1  43.95,107.3 0 top
S2  41.55,102.5 0 top
S3  40.95,27.85 180 top
S4  43.75,22.9 180 top
T4  63.5,19.7 270 top
U1  86.1,104.75 0 top
U4  55,100.9 0 top
U$1  42.67,71.42 0 top
U$2  42.7,81.75 180 top
U$3  42.55,49.7 0 top
U$4  42.65,60.15 180 top
U$13  56.2,24.3 90 top

### Tracks (layer width: path | path; a pad name or v marks a point on that pad's centre or on a via)
+3V3  (via drill 0.9 pad 1.7)  (15 unrouted)
  Top 0.305: C4.2 49.3,84.05
  Top 0.406: IC2.62 IC2.61 73.95,76.08 C7.1 | U1.2 86.1,101.35 86.3,101.15 86.3,101.6 85.95,101.95 | U$4.20 U$4.19 42.95,56.23 42.95,55.65 41.6,54.3 41.6,53.62 U$3.20 42.2,53.6 | U$3.19 42.2,53.6 | 91,57.95 89.05,57.95 87.22,59.78 IC2.35 80.36,59.78 | 91,57.95 92.45,57.95 92.5,58 92.5,59.55 92.45,59.6 | C13.1 92.54,57.95 95.05,57.95 v96.65,56.35 | v90.95,54.1 91,54.15 91,57.95 | R15.3 71.3,28.3 72.92,29.93 | 72.92,29.93 74.85,31.85 90.8,31.85 v93.45,29.2 | v73.95,28.85 73.95,28.9 72.92,29.93 | R12.1 65.75,31.25 v67.35,29.65 | IC1.4 71.15,106.55 71.15,107.5 75.35,107.5 75.35,105.8 | R2.3 75.4,104.35 77.05,102.7 77.35,102.7 | 77.35,102.7 78.86,102.7 | 78.86,102.7 R19.2 | v70.25,95.1 74.9,95.1 74.9,99.35 77.35,99.35 77.35,102.7 | 45.8,95.58 v45.8,95.25 45.8,97.23 R13.1 | 78.86,102.7 78.86,102.04 79.8,101.1 79.8,100.05 79.85,100 | 85.95,101.95 85.95,100.2 84.7,98.95 82.6,98.95 81.6,99.95 79.85,99.95 C25.2 | 85.95,101.95 85.95,107.7 U1.4 86.35,107.6 v92.7,107.6 | 80.36,67.75 73.95,67.75 73.95,71.85 | 80.36,67.75 85.4,67.75 | IC2.53 80.36,67.75 | 80.36,59.78 80.36,67.75 | 80.36,59.78 77.96,59.78 | 77.96,59.78 IC2.25 77.96,54.41 77.55,54 77.55,49.45 C11.1 | 77.96,59.78 73.25,59.78 73.25,58.95 69.76,58.95 | 69.76,58.95 IC2.15 | IC6.4 v89.3,25.25 | U$1.20 U$1.19 42.35,76.05 43,76.7 43,77.83 U$2.19 43.65,77.85 | 69.76,58.95 68.25,58.95 67.6,58.3 67.6,50.48 C9.1 | 49.3,84.05 49.3,84.9 v48.1,85.65 | 42.2,53.6 42.15,53.65 | C17.2 46.45,36.45 v46.45,40.75 46.45,43.25 47.5,44.3 47.5,47.5 46.75,48.25 45,48.25 42.2,51.05 42.2,53.6 | U$2.20 43.67,82.25 47.95,82.25 49.6,83.9
  Bottom 0.406: JP15.3 97.55,61.94 97.55,63.8 93.6,63.8 | 93.6,63.8 93.6,77.9 92.63,79.14 | 92.63,79.14 92.5,79.3 92.5,90.25 | JP1.3 93.7,36.21 JP2.3 88.5,36.26 JP3.3 83.15,36.31 JP4.3 80.85,36.36 80.85,42.6 90.95,52.7 v90.95,54.1 | v96.65,56.35 93.6,59.4 93.6,63.8 | 88.35,36.3 88.4,36.35 88.5,36.25 88.5,34.2 93.45,29.25 v93.45,29.2 89.5,25.25 v89.3,25.25 | 67.6,36.95 67.6,34.45 78.01,34.45 JP16.4 78.01,32.91 v73.95,28.85 | v67.35,29.65 67.35,34.2 67.65,34.5 46.45,34.5 46.45,40.7 | 70.25,92.4 v70.25,95.1 | 45.8,92.4 v45.8,95.25 45.85,95.25 45.85,97.25 56.49,97.25 | JP9.3 56.49,97.25 | 56.49,97.25 62.1,97.25 | JP7.2 62.1,97.25 | 62.1,97.25 62.1,101.85 65.65,101.85 65.65,98 68.6,95.05 70.3,95.05 70.35,95.1 | JP18.5 94.68,90.23 104.05,99.6 104.05,108.8 93.9,108.8 v92.7,107.6 | R6.2 91.69,78.2 92.63,79.14 | v48.1,85.65 45.7,83.3 45.7,41.65 46.45,40.9 v46.45,40.75
+12V  (via drill 0.9 pad 1.7)  (4 unrouted)
  Top 0.406: 91.6,101.65 C23.2 91.85,101.5 | 88.55,101.51 U1.3 | U$3.14 U$3.13 46.13,54.78 46.2,54.85 46.2,56.23 U$4.24 | 50.85,62.8 47.45,62.8 46.3,61.65 39.72,61.65 U$4.14 U$4.13 39.05,56.23 39.05,55.2 38.98,55.13 U$3.24 | U$2.14 U$2.13 39.1,77.84 U$1.24 39.1,70.05 46.85,70.05 48.35,68.55 51.15,68.55 | U$2.24 46.27,75.34 U$1.13 U$1.14
  Top 0.61: 76.52,95.15 76.52,92.77 73.7,89.95 61.5,89.95 60.2,88.65 60.2,86.5 63.55,83.15 v63.55,83 | v55.6,80.45 55.6,78.35 55.35,78.1 56.05,77.4 56.05,75.35 | 56.05,75.35 56.05,74.45 | 53.9,75.35 53.4,75.35 53.4,63.65 | 53.9,75.35 56.05,75.35 | C29.+ 53.3,63.85 | C15.+ C19.+ 53.4,56.65 53.4,63.65 | 53.4,63.65 53.25,63.65 | 76.52,95.15 83.85,95.15 88.45,99.75 88.45,101.61 U1.3 91.6,101.65 | 76.52,95.15 76.52,97.05 R10.2 | 91.85,101.5 100.55,101.5 106.75,95.3 106.75,94.2 JP10.4 | 51,56.45 51,62.8 | 51,62.8 51,65.8 C18.2 51.4,65.8 51.4,68.55 | 50.85,62.8 51,62.8 | 46.27,75.34 51.4,75.34 | 51.4,75.34 51.4,68.55 | 51.4,75.34 53.9,75.34 53.9,75.35 | 51.15,68.55 51.4,68.55 | 51,56.45 52.55,56.45 | 51,56.45 46.45,56.45 46.3,56.3
  Bottom 0.61: v55.6,80.45 54.1,81.95 54.05,81.95 55.25,83.15 63.4,83.15 63.5,83.05 | v63.55,83 63.5,83.05 | 63.5,83.05 63.45,83.05 62.35,84.15
BAT_V_ADC
  Top 0.406: IC2.2 64.25,69.38 64.25,80.4 58,86.65 58,95.2 60.75,97.95 69.25,97.95 70.3,99 70.3,102.75 70.29,102.74 IC1.1 IC1.2
BUTTON_1
  Top 0.406: IC2.6 61.3,66.18 61.3,79 52.55,87.75 47.7,87.75 47.7,89.05 40.1,89.05 40.1,100.9 41.6,100.9 41.6,104.95 40.75,105.8 40.75,107.25 S1.1
BUTTON_2
  Top 0.406: IC2.7 60.55,65.38 60.55,78.65 52.15,87.05 47,87.05 47,88.4 39.4,88.4 39.4,99.6 38.35,99.6 38.35,102.5 S2.1
BUTTON_3
  Top 0.406: S3.1 47.15,27.85 48.05,28.75 48.05,36 56.45,44.4 60.05,44.4 61.65,46 61.65,61.05 65.15,64.55 69.73,64.55 IC2.8
BUTTON_4  (1 unrouted)
  Top 0.406: S4.1 46.9,24.2 48.8,26.1 48.8,35.7 56.75,43.65 60.4,43.65 62.4,45.65 62.4,60.75 65.4,63.75 69.8,63.75 69.9,63.85
BUZZ  (via drill 0.9 pad 1.7)  (1 unrouted)
  Top 0.406: R20.2 51.9,35.7 v51.8,35.8 | v88.6,68.9 88.25,68.55 85.3,68.55
  Bottom 0.406: v51.8,35.8 51.8,40.4 54.95,43.55 72.45,43.55 75.2,46.3 80.9,46.3 85.85,51.25 85.85,66.15 v88.6,68.9
D_SHARP  (via drill 0.9 pad 1.7)
  Top 0.406: IC2.3 63.5,68.58 63.5,80.1 53.75,89.85 49.8,89.85 49.8,93.95 51.25,95.4 52.1,95.4 v52.55,94.95
  Bottom 0.406: v52.55,94.95 53.65,94.95 53.95,94.65 JP9.2
DEBUG_RX  (via drill 0.9 pad 1.7)  (1 unrouted)
  Top 0.406: v56.6,40.3 56.65,40.3 58.5,42.15 61.15,42.15 63.45,44.45 66.4,44.45 72.35,50.4 72.35,56.45 72.4,56.5
  Bottom 0.406: JP11.1 54.58,38.28 v56.6,40.3
DEBUG_TX  (via drill 0.9 pad 1.7)
  Top 0.406: v60.3,40.4 60.5,40.4 63.85,43.75 66.85,43.75 73.15,50.05 IC2.19
  Bottom 0.406: JP11.2 57.12,38.42 59.1,40.4 v60.3,40.4
DISP_D/C  (via drill 0.9 pad 1.7)
  Top 0.406: IC2.39 96.98,62.98 98.65,64.65 98.65,70 v98.2,70.45
  Bottom 0.406: v98.2,70.45 99.09,69.56 JP15.6
DISP_MOSI  (via drill 0.9 pad 1.7)  (1 unrouted)
  Top 0.406: IC2.41 94.63,64.58 v95.95,65.9
  Bottom 0.406: v95.95,65.9 98.3,65.9 99.4,67 101.7,67 101.75,66.95
DISP_RST  (via drill 0.9 pad 1.7)  (1 unrouted)
  Top 0.406: IC2.38 97.33,62.18 99.55,64.4 99.55,72.6 v98.3,73.85
  Bottom 0.406: v98.3,73.85 99.05,74.6 101.75,74.6
DISP_SCK  (via drill 0.9 pad 1.7)  (1 unrouted)
  Top 0.406: IC2.43 93.08,66.18 v95.25,68.35
  Bottom 0.406: v95.25,68.35 94.55,67.65 94.55,64.5 94.6,64.45 101.75,64.45
DISP_SS  (via drill 0.9 pad 1.7)  (1 unrouted)
  Top 0.406: IC2.40 96.48,63.78 97.6,64.9 97.6,67.95 v97.45,68.1
  Bottom 0.406: v97.45,68.1 96.45,69.1 96.45,72.15 101.9,72.15
EDGE_SENS_A_1  (via drill 0.9 pad 1.7)  (1 unrouted)
  Top 0.406: IC6.3 93.13,23.98 101.75,32.6 101.75,37.35
  Bottom 0.406: v101.75,37.45 101.75,38.25 101.25,38.75 JP1.2
EDGE_SENS_A_2  (via drill 0.9 pad 1.7)  (1 unrouted)
  Top 0.406: IC6.5 94.52,26.52 96.4,28.4 96.4,37.4 v96.25,37.55
  Bottom 0.406: v96.25,37.55 96.25,38.25 95.75,38.75 93.65,38.75
EDGE_SENS_A_3  (via drill 0.9 pad 1.7)
  Top 0.406: IC6.10 76.98,26.52 75.6,27.9 75.6,30.35 89.85,30.35 93,27.2 94.05,27.2 95.6,28.75 95.6,30.3 91,34.9 v91,37.6
  Bottom 0.406: v91,37.6 91,38.6 90.75,38.85 JP3.2
EDGE_SENS_A_4  (via drill 0.9 pad 1.7)
  Top 0.406: v85.75,37.65 85.75,35 84,33.25 74.25,33.25 69.05,28.05 69.05,24.8 70.25,23.6 70.3,23.6 70.95,24.25 74.4,24.25 74.67,23.98 IC6.12
  Bottom 0.406: v85.75,37.65 85.75,38.35 85.2,38.9 JP4.2
EDGE_SENS_OUT_1  (2 unrouted)
  Top 0.406: 84.95,21.45 84.9,21.5 | IC6.1 91.74,21.44 103.45,33.15 103.45,47.4 98.8,52.05 98.8,59.7 97.1,61.4 85.4,61.4
EDGE_SENS_OUT_2  (via drill 0.9 pad 1.7)
  Top 0.406: IC2.36 88.77,60.58 v89.4,59.95 | v87.9,28.7 87.3,28.7 86.95,29.05 85.11,29.05 IC6.7
  Bottom 0.406: v89.4,59.95 89.4,52.2 80.1,42.9 80.1,31.85 83.2,28.75 87.85,28.75 v87.9,28.7
EDGE_SENS_OUT_3  (via drill 0.9 pad 1.7)
  Top 0.406: IC2.33 86.17,58.18 v87.5,56.85 | v77.2,28.6 77.75,28.6 78.2,29.05 79.89,29.05 IC6.8
  Bottom 0.406: v87.5,56.85 87.5,51.3 79.35,43.15 79.35,30.75 v77.2,28.6
EDGE_SENS_OUT_4  (1 unrouted)
  Top 0.406: IC6.14 75.69,21.44 74.8,20.55 72.35,20.55 68.45,24.45 68.45,28.4 74,33.95 79.75,33.95 80.95,35.15 80.95,44.3 83.55,46.9 83.55,56.25
GND  (via drill 0.5 pad 0.61, 0.9 pad 1.7)  (1 unrouted)
  Top 0.305: 48,41.7 48.15,41.15
  Top 0.406: U$4.9 40.9,63.22 40.9,63.95 | 44.5,63.95 44.5,63.2 | U$4.18 42.32,59.15 47.4,59.15 arc-90 47.65,59.4 v48.1,59.45 | U$1.18 43,72.6 48.45,72.6 48.45,72.3
  other vias: 48.5,72.3 47.8,63.95 98.5,33 86.9,33.2 69.45,51.6 74.4,51 66.85,71.95 75.5,101.4 60.95,106.35 43.25,95.05 36.75,71.95 37.15,81.1 37.4,94.3 92.4,46.9 89.3,19.2 49.6,53.4 48.75,39.95 96.75,80.6
  pour Top: 41,16 104,16 119,31 119,99 104,114 41,114 33,99 33,31
  pour Bottom: 41,16 104,16 119,31 119,99 104,114 41,114 33,99 33,31
IR_OUT  (1 unrouted)
  Top 0.406: IC2.5 62,66.98 62,79.35 52.95,88.4 48.4,88.4 48.4,89.7 40.75,89.7 40.75,100.05 45.8,100.05 49.15,103.4 52.45,103.4 U4.1
LED_0  (1 unrouted)
  Top 0.406: R9.2 50.32,23.03 49.45,23.9 49.45,35.35 57,42.9 60.9,42.9 63.3,45.3 66.15,45.3 71.55,50.7 71.55,56.25
LED_1  (via drill 0.9 pad 1.7)
  Top 0.406: v88.6,71.2 88.55,71.2 86.75,69.4 85.38,69.4 IC2.47
  Bottom 0.406: R7.2 74.6,21.95 89.85,21.95 103.8,35.9 103.8,44.2 91.3,56.7 91.3,68.5 v88.6,71.2
LED_2  (via drill 0.9 pad 1.7)
  Top 0.406: v90.9,72.45 90.1,72.45 89.6,72.95 88.25,72.95 86.45,71.15 86.45,70.3 86.35,70.2 85.38,70.2 IC2.48
  Bottom 0.406: R3.2 66.48,26.22 71.55,21.15 90.1,21.15 104.55,35.6 104.55,44.5 92,57.05 92,71.35 v90.9,72.45
LED_3  (via drill 0.9 pad 1.7)  (1 unrouted)
  Top 0.406: v90.3,75.45 85.85,75.45 83.55,73.15 83.55,72.05 83.5,72
  Bottom 0.406: R8.2 100.5,30.5 105.3,35.3 105.3,44.75 92.7,57.35 92.7,73.05 v90.3,75.45
LED_4  (via drill 0.9 pad 1.7)  (1 unrouted)
  Top 0.406: IC2.50 82.76,73.31 v86.7,77.25 | v47.75,104.1 47.75,104.15 49.9,106.3 49.9,110.7 49.75,110.85
  Bottom 0.406: v86.7,77.25 86.7,75.95 83.1,72.35 70.15,72.35 70.15,86.7 58.6,86.7 56.8,88.5 43.9,88.5 41.15,91.25 41.15,98.7 45.05,102.6 46.25,102.6 v47.75,104.1
LED_5  (via drill 0.9 pad 1.7)  (1 unrouted)
  Top 0.406: v83.9,77.05 83.9,75.4 81.95,73.45 81.95,72.15 81.9,72.1
  Bottom 0.406: R1.2 83.55,103.35 82.35,102.15 82.35,85.9 75.05,78.6 75.05,76.4 80.05,76.4 81,77.35 82.45,77.35 82.75,77.05 v83.9,77.05
LED_6  (via drill 0.9 pad 1.7)  (1 unrouted)
  Top 0.406: v81.6,75.75 81.6,74.7 79.55,72.65 79.55,71.65 79.6,71.6
  Bottom 0.406: R5.2 78.13,106.35 80.2,106.35 81.7,104.85 81.7,86.25 74.35,78.9 74.35,75.75 v81.6,75.75
LED_7  (via drill 0.9 pad 1.7)  (1 unrouted)
  Top 0.406: v79.2,74.25 78.75,73.8 78.75,71.85
  Bottom 0.406: R21.2 67.34,103.61 81.05,89.9 81.05,86.6 73.6,79.15 73.6,74.25 v79.2,74.25
M1_IN1  (via drill 0.9 pad 1.7)  (2 unrouted)
  Top 0.305: 44.3,77.65 44.3,77.83 | 41.05,75.55 U$1.21
  Top 0.406: 44.3,78 44.3,77.65 | 41.05,75.55 41.05,75.95 41.7,76.6 41.7,77.83 U$2.17 | U$1.17 43.65,76.45 | 43.65,76.45 44.3,77.1 44.3,77.83 U$2.21 | 43.65,76.45 43.65,73.15 49.3,73.15 49.3,70.55 49,70.55 47.55,72 41.05,72 U$1.21 | IC2.10 66.93,62.98 v66.1,62.15 | 44.3,77.9 44.35,77.85 | v51.8,81.55 44.35,81.55 44.35,77.8
  Bottom 0.406: v66.1,62.15 66.1,67.25 v51.8,81.55
M1_IN2  (via drill 0.9 pad 1.7)
  Top 0.406: U$2.16 41.05,77.83 41.05,76.75 40.4,76.1 U$1.22 40.4,71.35 47.3,71.35 48.75,69.9 49.9,69.9 49.9,73.8 44.3,73.8 44.3,76.35 | U$1.16 44.3,76.35 | 44.3,76.35 44.95,77 44.95,77.83 U$2.22 44.97,80.9 48.65,80.9 49.8,79.75 v50.1,79.75 | IC2.11 68.33,62.18 65.55,59.4 64.8,59.4 v64.15,60.05
  Bottom 0.406: v64.15,60.05 64.15,68.2 52.9,79.45 50.4,79.45 v50.1,79.75
M1_OUT_1
  Top 0.305: U$2.1 U$2.2 | U$1.2 U$1.1 | U$1.11 U$1.12
  Top 0.406: U$1.2 39.75,66.05 45.6,66.05 U$1.11 | U$2.11 U$2.12 38.92,85.47 | 34.7,67.7 U$1.1 | U$2.2 45.62,87.7 39.77,87.7 U$2.11 | JP6.4 34.7,35.89 34.7,67.7 | 34.7,67.7 34.7,85.47 U$2.11
M1_OUT_2  (via drill 0.9 pad 1.7)  (1 unrouted)
  Top 0.305: U$2.8 U$2.7 U$2.6 U$2.5 | U$1.8 U$1.7 U$1.6 U$1.5
  Top 0.406: JP6.3 35.4,38.43 35.4,65.75 v36.2,65.75 v38,65.75 | U$1.8 42.65,67.7 42.65,69.4 35.45,69.4 35.45,77.75 | 35.45,77.75 35.45,83.65 42.65,83.65 42.65,85.5 | 35.55,75.6 35.6,75.65 v36.9,75.65 36.9,77.65 | 35.45,77.75 36.9,77.75 36.9,77.65 | 36.85,77.65 36.9,77.65
  Bottom 0.406: v38,65.75 38,74.55 v36.9,75.65 36.95,75.65 36.95,77.7
M1_PWM  (via drill 0.9 pad 1.7)
  Top 0.406: U$2.15 40.4,77.83 40.4,76.9 39.75,76.25 U$1.23 39.75,70.7 47,70.7 48.45,69.25 50.55,69.25 50.55,74.4 44.95,74.4 44.95,76.1 | U$1.15 44.95,76.1 | 44.95,76.1 45.6,76.75 45.6,77.75 45.6,77.83 | 45.6,77.83 U$2.23 | IC2.16 69.45,58.18 v69.45,54.15 | v49.5,77.6 49.5,78.25 47.5,80.25 45.6,80.25 45.6,77.83
  Bottom 0.406: v69.45,54.15 69.45,54.2 66.2,57.45 63.95,57.45 61.55,59.85 61.55,69.75 53.65,77.65 49.55,77.65 v49.5,77.6
M2_IN1  (via drill 0.9 pad 1.7)
  Top 0.406: 41.7,56.22 41.7,59.8 47.15,59.8 48.25,60.9 48.95,60.9 48.95,58.6 44.25,58.6 44.25,56.25 U$4.21 44.3,56.22 44.3,55.25 43.53,54.48 U$3.17 43.55,53.58 43.55,52 45.55,50 47.3,50 49,48.3 49,45.7 50.4,44.3 v50.4,44.15 | IC2.12 68.73,61.38 64.1,56.75 64.1,52.85 v64.15,52.8 | U$3.21 40.93,54.48 41.7,55.25 41.7,56.22 | 41.7,56.22 U$4.17
  Bottom 0.406: v64.15,52.8 64.15,47 62.75,45.6 54.4,45.6 51.35,48.65 49.9,48.65 48.8,47.55 48.8,45.75 v50.4,44.15
M2_IN2  (via drill 0.9 pad 1.7)  (1 unrouted)
  Top 0.406: 41,56.23 41,60.4 46.85,60.4 48,61.55 49.6,61.55 49.6,58 44.92,58 U$4.22 | IC2.13 68.83,60.58 66.05,57.8 v66.05,54.8 | U$3.22 40.28,54.68 41,55.4 41,56.23 | 41,56.23 U$4.16 | 44.95,56.2 44.95,55.15 44.18,54.38 U$3.16 44.15,53.57 44.15,52.3 45.7,50.75 47.5,50.75 50.8,47.45 v50.8,46.55
  Bottom 0.406: v66.05,54.8 66.05,46.4 64.6,44.95 52.4,44.95 v50.8,46.55
M2_OUT_1  (1 unrouted)
  Top 0.406: U$3.1 U$3.2 36.25,45.98 | U$3.12 U$3.11 45.48,44.68 41.75,40.95 39.36,40.95 JP6.2 39.34,41 36.25,41 36.25,45.98 | U$4.12 U$4.11 | U$4.1 U$4.2 | U$4.11 36.25,63.87 36.25,45.98 | U$4.11 39.72,65.4 45.55,65.4 45.55,63.9 45.65,63.9
M2_OUT_2
  Top 0.406: U$4.6 U$4.7 U$4.8 | U$3.5 U$3.6 | U$3.6 U$3.7 | U$3.7 U$3.8 | JP6.1 41.11,43.51 42.55,44.95 42.55,45.66 U$3.6 | U$4.5 U$4.6 | U$4.6 42.97,62.3 37.5,62.3 37.5,48 42.55,48 42.55,45.98 U$3.7
M2_PWM  (via drill 0.9 pad 1.7)
  Top 0.406: 45.6,56.25 U$4.23 | U$4.23 45.57,57.4 50.2,57.4 50.2,62.2 47.75,62.2 46.6,61.05 40.35,61.05 40.35,56.22 U$4.15 40.35,56.23 40.35,55.6 39.63,54.88 U$3.23 | U$4.23 45.55,56.23 45.55,54.95 44.83,54.23 U$3.15 44.85,53.58 44.85,52.55 46,51.4 47.85,51.4 52.3,46.95 v52.3,43.1 | IC2.26 78.76,52.44 v79.05,52.15
  Bottom 0.406: v79.05,52.15 79.05,51.2 72.15,44.3 53.5,44.3 v52.3,43.1
N$1
  Bottom 0.406: LED1.A 102.58,106.19 R1.1
N$2
  Top 0.406: R4.1 44.52,110.88 LED5.A
N$3
  Bottom 0.406: R5.1 78.03,103.91 LED6.A
N$4
  Bottom 0.406: LED3.A 48.85,23.65 51.1,23.95 50.78,23.95 R3.1
N$5  (1 unrouted)
  Bottom 0.406: LED7.A 75.05,26 74.65,26.4
N$6  (1 unrouted)
  Bottom 0.406: LED8.A 100.9,23.95 100.45,23.5
N$7  (1 unrouted)
  Top 0.406: R9.1 47.43,19.05 44.6,19.05
N$8
  Top 0.406: R13.2 50.08,100.07 52,98.15 54.1,98.15 55.1,99.15 55.1,100.8 U4.2
N$9
  Top 0.61: JP10.2 JP10.3
N$11
  Top 0.406: D1.C 63.3,27.6 61.75,29.15 61.75,29.9 | 61.75,29.9 61.75,31.22 R12.2 | U$13.P$2 61.61,29.76 61.75,29.9
N$12  (via drill 0.9 pad 1.7)
  other vias: 36.9,77.7
N$13  (via drill 0.9 pad 1.7)
  other vias: 54.3,81.7
N$14  (via drill 0.9 pad 1.7)  (1 unrouted)
  Top 0.406: IC2.56 77.96,75.11 78.7,75.85 79.5,75.85 82.35,78.7 83.2,78.7 v85.6,81.1
  Bottom 0.406: v85.6,81.1 84.6,82.1 84.6,95.1 92.55,95.1 92.55,92.75
N$15  (via drill 0.9 pad 1.7)  (1 unrouted)
  Top 0.406: IC2.57 77.16,76.56 v78.35,77.75
  Bottom 0.406: v78.35,77.75 79.25,77.75 80.2,78.7 86.05,78.7 88.35,81 89.27,81 R6.1 | JP18.2 85.3,92.77 85.3,84.3 88.65,80.95
N$16  (2 unrouted)
  Top 0.406: 106.75,86.5 JP10.1
  Top 0.61: JP14.2 99.1,86.5 106.7,86.5
N$17  (2 unrouted)
  Top 0.406: 68.75,109.09 IC1.9 60.94,109.09 59.5,107.65 59.5,105 60.55,103.95 63.65,103.95 63.7,104 | 68.75,109.09 68.75,109.15 | 68.75,109.09 71.59,109.09 71.95,109.45 R2.2
N$18  (1 unrouted)
  Top 0.406: 56.45,18.8 56.5,18.85 57.5,18.85 58.75,17.6 63.7,17.6 64.6,18.5 T4.3 64.6,20.95 65.15,21.5 D1.A
N$19  (via drill 0.9 pad 1.7)
  other vias: 62.4,84.1
N$20
  Top 0.61: 55.55,80.45 54.3,81.75
N$21
  Top 0.406: T4.1 61.9,20.65 58.25,24.3 53.4,24.3 51.8,25.9 51.8,29.43 R20.1
N$22  (1 unrouted)
  Top 0.406: IC6.9 IC6.6 82.56,27.79 82.55,27.8 82.55,22.81 82.45,22.71 | IC6.13 82.45,22.71 | 82.45,22.71 IC6.2 | R15.2 72.6,22.65 79.95,22.65
N$23
  Top 0.406: 118.95,16 104.05,16 | 104.05,16 41,16 | 41,16 33,16 33,31 | 33,31 33,114 41,114 | 41,114 104.05,114 | 104.05,114 119,114 119,99 | 119,99 119,31 | 119,31 119,16 | 104.05,16 104.05,16.05 119,31 | 104.05,114 104.05,113.95 119,99 | 33.05,99.05 41,114 | 33,31 41,16
N$24
  Bottom 0.406: R14.2 101.78,59.37 JP15.2
N$25
  Bottom 0.406: 33,99 33,114 41,114 | 33,99 33,31 | 33,31 33,16 41,16 | 41,16 119,16 119,99 | 119,99 119,114 104.15,114 | 104.15,114 41,114 | 104.15,114 104.15,113.85 119,99 | 41,16 33,31 | 33,99 41,114
N$26
  Bottom 0.406: 104.2,16.15 104.2,16.2 119.05,31.05
N$27  (1 unrouted)
  Top 0.406: R10.1 73.48,98.82 72.65,99.65 | IC1.3 70.17,105.28 71.15,104.3 71.15,99.8 71.3,99.65 72.88,99.65 R11.2
N$28
  Top 0.406: 112.9,110.25 117.35,110.25
N$29
  Top 0.406: 115.1,112.25 115.1,108.15
N$30
  Top 0.406: 112.7,20.7 117.15,20.7
N$31
  Top 0.406: 114.9,22.7 114.9,18.6
N$32
  Top 0.406: 33.5,19.3 37.95,19.3
N$33
  Top 0.406: 35.7,21.3 35.7,17.2
N$34
  Top 0.406: 33.55,111.15 38,111.15
N$35
  Top 0.406: 35.75,113.15 35.75,109.05
N$36
  Bottom 0.406: 117.3,110.25 112.85,110.25
N$37
  Bottom 0.406: 115.1,112.25 115.1,108.15
N$38
  Bottom 0.406: 35.75,108.95 35.75,113.4
N$39
  Bottom 0.406: 37.75,111.15 33.65,111.15
N$40
  Bottom 0.406: 117.1,20.7 112.65,20.7
N$41
  Bottom 0.406: 114.9,22.7 114.9,18.6
N$42
  Bottom 0.406: 37.9,19.3 33.45,19.3
N$43
  Bottom 0.406: 35.7,21.3 35.7,17.2
N$64  (1 unrouted)
  Top 0.406: IC2.58 76.36,78.51 79.05,81.2 Q2.1 | C40.1 82.09,84.79 80.7,83.4 80.7,81.4 80.75,81.35
N$65  (1 unrouted)
  Top 0.406: C39.1 72.19,82.19 Q2.2 | IC2.59 75.56,78.39 72.75,81.2 71.25,81.2 71.2,81.15
N$67
  Top 0.406: R19.1 78.94,108 LED2.A
N$69  (1 unrouted)
  Bottom 0.406: R21.1 52.01,106.1 49.85,106.1
SHARP1_OUT  (via drill 0.9 pad 1.7)  (2 unrouted)
  Top 0.406: v72.75,88.3 67.3,88.3 67.3,74.45 72.35,74.45 72.35,71.95 | IC1.5 66.65,107.82 66.65,100.45 67.45,100.45 v67.45,100.4
  Bottom 0.406: v67.45,100.4 67.45,100.05 72.7,94.8 72.7,92.39 JP5.3 | v72.75,88.3 72.75,92.25
SHARP2_OUT  (via drill 0.9 pad 1.7)
  Top 0.406: v65.7,88.2 66.55,87.35 66.55,73.8 71.56,73.8 IC2.64 | IC1.10 65.85,107.82 65.85,100.5 64.35,100.5 v63.95,100.1
  Bottom 0.406: JP7.3 64.65,89.25 v65.7,88.2 | v63.95,100.1 63.95,94.55 64.65,93.85 JP7.3 | JP7.3
SHARP3_OUT  (via drill 0.9 pad 1.7)
  Top 0.406: IC1.12 65.15,105.28 65.15,101.45 62.85,101.45 58,96.6 51.25,96.6 49.7,95.05 v48.5,95.05 | IC2.1 64.95,70.18 64.95,86.35 v62.85,88.45
  Bottom 0.406: v48.5,95.05 48.34,95.05 JP8.3 48.3,92.41 48.3,90.2 49.35,89.15 57.1,89.15 58.85,87.4 60.9,87.4 61.95,88.45 v62.85,88.45
SHARP_INT_1  (via drill 0.9 pad 1.7)
  Top 0.406: IC2.23 76.36,52.81 v75.9,52.35 | v71.6,111.15 70.81,110.36 IC1.7
  Bottom 0.406: v75.9,52.35 75.9,71.65 69.5,71.65 69.5,86 58.3,86 56.45,87.85 43.55,87.85 40.5,90.9 40.5,99.1 49.7,108.3 65.65,108.3 68.5,111.15 v71.6,111.15
SHARP_INT_2  (via drill 0.9 pad 1.7)
  Top 0.406: IC2.22 75.56,55.06 v74.5,54 | v59.35,110.35 63.34,110.35 IC1.8
  Bottom 0.406: v74.5,54 75.2,54.7 75.2,70.95 68.8,70.95 68.8,85.35 58,85.35 56.15,87.2 43.25,87.2 39.8,90.65 39.8,99.35 49.55,109.1 58.1,109.1 v59.35,110.35
SHARP_INT_3  (1 unrouted)
  Top 0.406: IC2.4 62.75,67.78 62.75,79.7 53.35,89.1 49.1,89.1 49.1,90.35 41.45,90.35 41.45,98.6 50.35,98.6 51.65,97.3 57.6,97.3 61.4,101.1 61.4,102.75 63.3,102.75
SONAR2_ECHO  (via drill 0.9 pad 1.7)
  Top 0.406: v63.1,40.45 65.5,42.85 67.7,42.85 72.55,47.7 79.65,47.7 80.35,48.4 IC2.28
  Bottom 0.406: JP17.2 62.48,39.83 v63.1,40.45
SONAR2_TRIG  (via drill 0.9 pad 1.7)
  Top 0.406: v65.85,40.5 66.45,40.5 72.95,47 80.2,47 81.15,47.95 IC2.29
  Bottom 0.406: JP17.3 65.02,39.67 v65.85,40.5
SONAR_ECHO  (via drill 0.9 pad 1.7)  (1 unrouted)
  Top 0.406: v68.9,40.55 68.9,41.45 73.75,46.3 80.65,46.3 81.95,47.6 81.95,56.2 81.9,56.25
  Bottom 0.406: JP16.2 72.93,38.67 72.5,39.1 70.35,39.1 v68.9,40.55
SONAR_TRIG  (via drill 0.9 pad 1.7)
  Top 0.406: v71.65,40.6 72.5,39.75 80.3,39.75 80.3,44.5 82.75,46.95 IC2.31
  Bottom 0.406: JP16.3 75.45,37.07 75.45,39.2 74.05,40.6 v71.65,40.6
(copper drawn outside any net)
  shapes: Bottom circle x2, Top circle x2

### Text on the board
Top: MINISUMO | BULLET XT
Bottom: ANDRZEJ LACZEWSKI | DESIGNED BY